# EAGLE design EbotSunny-v02 (EAGLE 7.7.0)
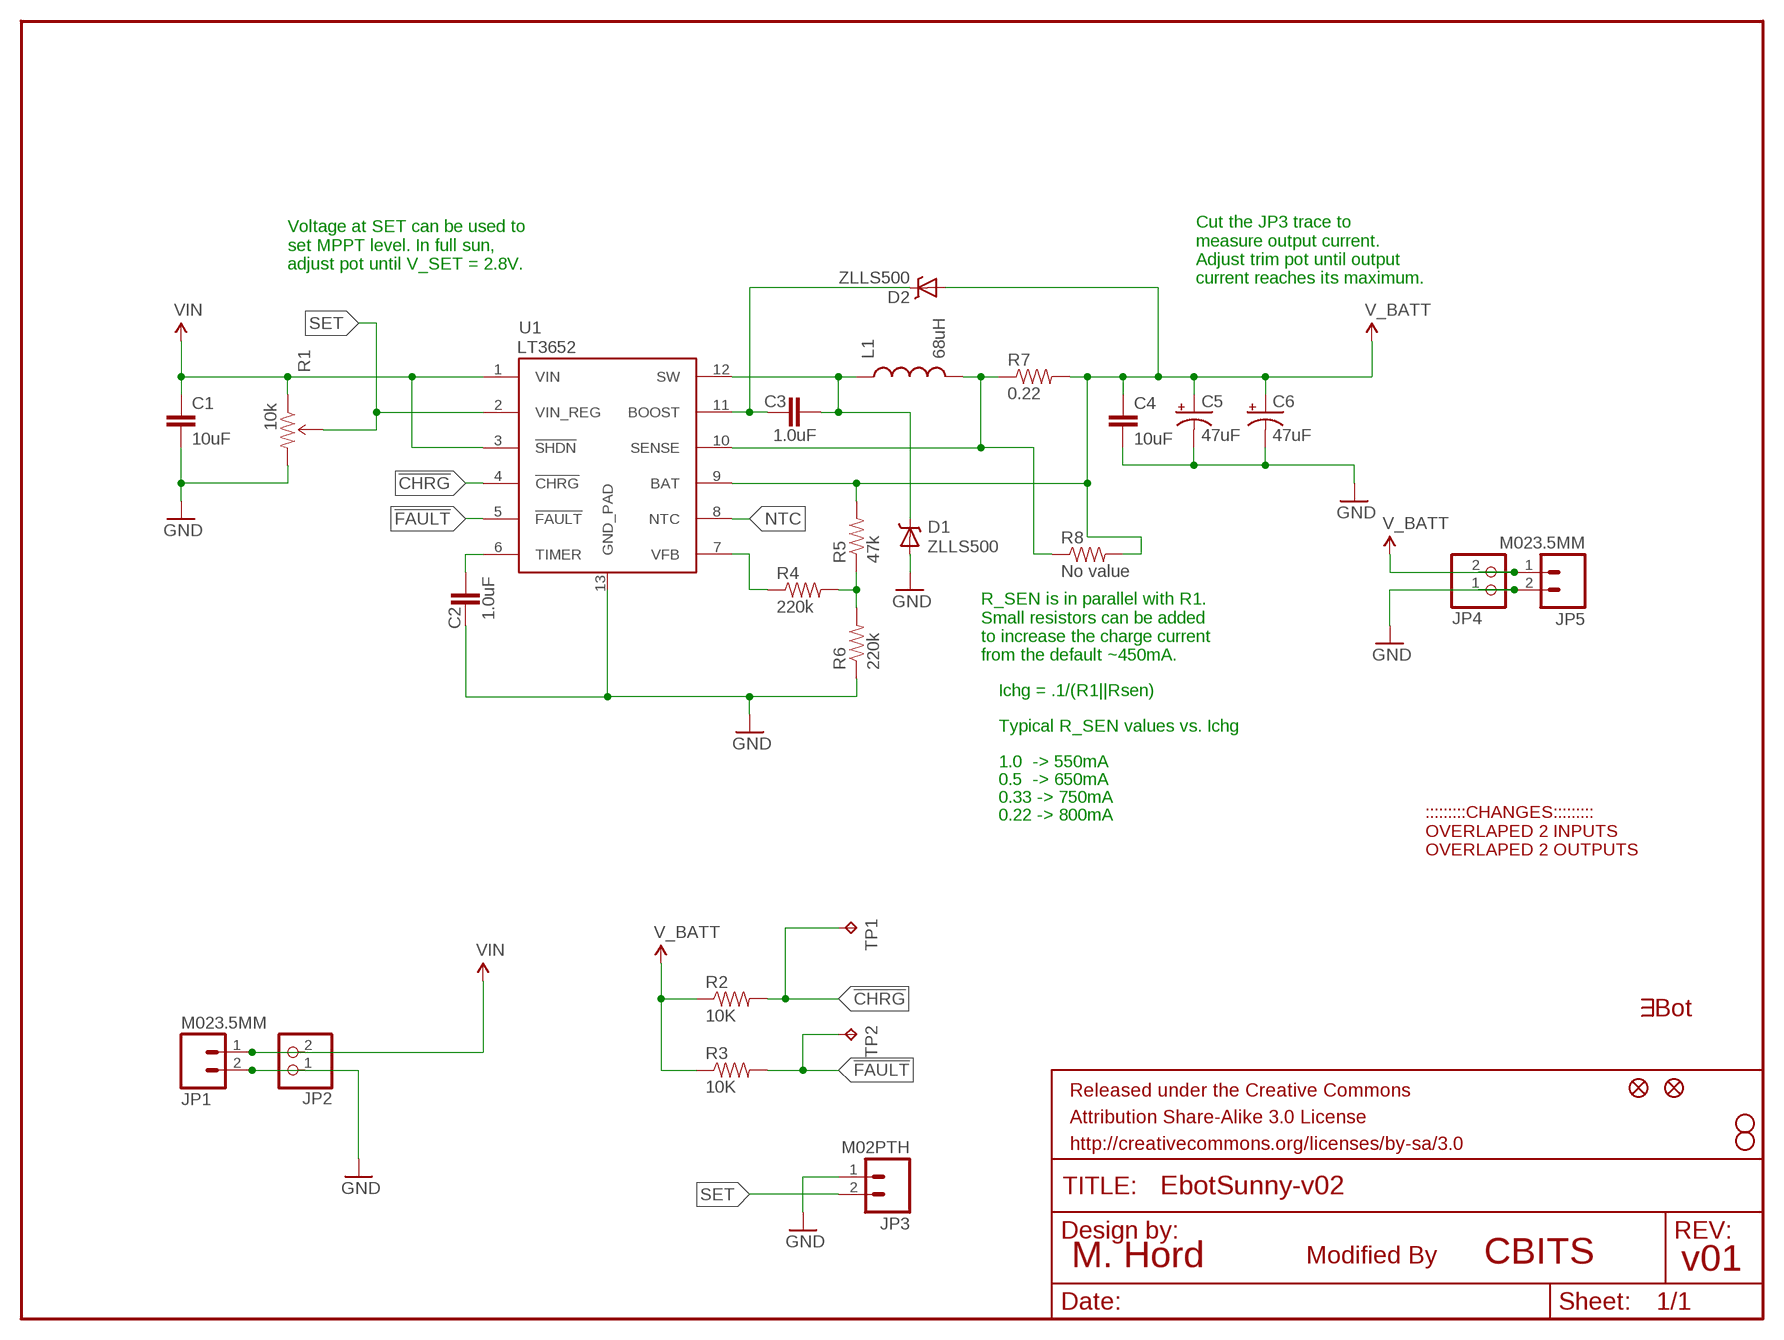
[diagram p0: schematic, sheet 1]

## Parts
C1  10uF  10UF50V20%(1210)  [1210]
C2  1.0uF  1.0UF-16V-10%(0603)  [0603-CAP]
C3  1.0uF  1.0UF-16V-10%(0603)  [0603-CAP]
C4  10uF  10UF-6.3V-20%(1206)  [1206]
C5  47uF  47UF-TANT  [EIA3528]
C6  47uF  47UF-TANT  [EIA3528]
D1  ZLLS500  ZLLS500ZLLS500  [SOT23]
D2  ZLLS500  ZLLS500ZLLS500  [SOT23]
EBOT_LOGO3  EBOT_NAME_6MM  [EBOT_NAME_6MM]
FID1  FIDUCIAL1X2  [FIDUCIAL-1X2]
FID2  FIDUCIAL1X2  [FIDUCIAL-1X2]
FRAME1  FRAME-LETTER  [CREATIVE_COMMONS]
JP1  M023.5MM  [SCREWTERMINAL-3.5MM-2]
JP2  PINHD-1X2  [1X02]
JP3  M02PTH  [1X02]
JP4  PINHD-1X2  [1X02]
JP5  M023.5MM  [SCREWTERMINAL-3.5MM-2]
L1  68uH  INDUCTOR68UH-1A  [CR75]
R1  10k  TRIMPOTRES-09285  [TRIMPOT-3MM]
R2  10K  10KOHM1/10W1%(0603)0603  [0603-RES]
R3  10K  10KOHM1/10W1%(0603)0603  [0603-RES]
R4  220k  220KOHM1/10W1%(0603)  [0603-RES]
R5  47k  47KOHM1/10W1%(0603)  [0603-RES]
R6  220k  220KOHM1/10W1%(0603)  [0603-RES]
R7  0.22  0.22OHM1/4W1%(0805)  [0805]
R8  No value  0.22OHM1/4W1%(0805)  [0805]
STANDOFF1  STAND-OFF  [STAND-OFF]
STANDOFF2  STAND-OFF  [STAND-OFF]
TP1  TPB1,27  [B1,27]
TP2  TPB1,27  [B1,27]
U1  LT3652  [MSOP-12_GND]

## Nets
!CHRG: R2.2 TP1.TP U1.4(!CHRG)
!FAULT: R3.2 TP2.TP U1.5(!FAULT)
BOOST: C3.1 D2.3(C) U1.11(BOOST)
FB: R4.2 R5.1 R6.2
GND: C1.2 C2.1 C4.2 C5.C(-) C6.C(-) D1.1(A) JP1.2 JP2.1 JP3.1 JP4.1 JP5.2 R1.3(CW) R6.1 U1.13(GND_PAD)
N$3: R4.1 U1.7(VFB)
NTC: U1.8(NTC)
SENSE: L1.P$2 R7.1 R8.1 U1.10(SENSE)
SET: JP3.2 R1.2(WIPER) U1.2(VIN_REG)
SW: C3.2 D1.3(C) L1.P$1 U1.12(SW)
TIMER: C2.2 U1.6(TIMER)
V_BATT: C4.1 C5.A(+) C6.A(+) D2.1(A) JP4.2 JP5.1 R2.1 R3.1 R5.2 R7.2 R8.2 U1.9(BAT)
VIN: C1.1 JP1.1 JP2.2 R1.1(CCW) U1.1(VIN) U1.3(!SHDN)

## Notes on the sheet
- Voltage at SET can be used to
  set MPPT level. In full sun,
  adjust pot until V_SET = 2.8V.
- Cut the JP3 trace to
  measure output current.
  Adjust trim pot until output
  current reaches its maximum.
- R_SEN is in parallel with R1.
  Small resistors can be added
  to increase the charge current
  from the default ~450mA.
- Ichg = .1/(R1||Rsen)
- Typical R_SEN values vs. Ichg
- 1.0  -> 550mA
- 0.5  -> 650mA
- 0.33 -> 750mA
- 0.22 -> 800mA
- :::::::::CHANGES:::::::::
  OVERLAPED 2 INPUTS
  OVERLAPED 2 OUTPUTS
- M. Hord | Modified By | CBITS
- v01

## Library data of the parts
C1 = SparkFun-Capacitors:10UF50V20%(1210): CAP-09824; PROD_ID: CAP-09824
C2 C3 = SparkFun-Capacitors:1.0UF-16V-10%(0603): CAP-00868; PROD_ID: CAP-00868
C4 = SparkFun-Capacitors:10UF-6.3V-20%(1206): Ceramic CAP-10057; PROD_ID: CAP-10057
C5 C6 = SparkFun-Capacitors:47UF-TANT: 47uF Tantalum SMT CAP-08310- 10V 10% (EIA-3528); PROD_ID: CAP-08310
D1 D2 = SparkFun-DiscreteSemi:ZLLS500: 700mA 40V SOT-23 Schottky; PROD_ID: DIO-08411
EBOT_LOGO3 = EbotLogos:EBOT_NAME_6MM
FID1 FID2 = SparkFun-Aesthetics:FIDUCIAL: Fiducial Alignment Points Various fiducial points for machine vision alignment.
FRAME1 = SparkFun-Aesthetics:FRAME-LETTER: Schematic Frame Standard 8.5x11 US Letter frame
JP1 JP3 JP5 = SparkFun-Connectors:M02: Standard 2-pin 0.1" header. Use with - straight break away headers ( PRT-00116) - right angle break away headers (PRT-00553) - swiss pins (PRT-00743) - machine pins (PRT-00117) - female headers (PRT-00115) Molex polarized connector foot print use with: PRT-08233 with associated crimp pins and housings. 2.54_SCREWTERM for use with PRT-10571. 3.5mm Screw Terminal footprints for PRT-08084 5mm Screw Terminal footprints for use with PRT-08433
JP2 JP4 = pinhead:PINHD-1X2: PIN HEADER
L1 = SparkFun-Passives:INDUCTOR: Inductors Basic Inductor/Choke - 0603 and 1206. Footprints are not proven and vary greatly between part numbers. SRN6045- 33uH, 20% 1.4A SDR0403-560KL - 56uH, 10%, 500mA RMS/740mA peak; PROD_ID: NDUC-09739
R1 = SparkFun-Electromechanical:TRIMPOT: Various small potentiometers for "set-and-forget" applications; PROD_ID: RES-09285
R2 R3 = SparkFun-Resistors:10KOHM1/10W1%(0603): RES-00824; PROD_ID: RES-00824
R4 R6 = SparkFun-Resistors:220KOHM1/10W1%(0603): RES-08969; PROD_ID: RES-08969
R5 = SparkFun-Resistors:47KOHM1/10W1%(0603): RES-07871; PROD_ID: RES-07871; VALUE: 47K
R7 = SparkFun-Resistors:0.22OHM1/4W1%(0805): RES-09883; PROD_ID: RES-09883
R8 = SparkFun-Resistors:0.22OHM1/4W1%(0805): RES-09883; PROD_ID: RES-09883; VALUE: 0.22
STANDOFF1 STANDOFF2 = SparkFun-Electromechanical:STAND-OFF: #4 Stand Off This is the mechanical footprint for a #4 phillips button head screw. Use the keepout ring to avoid running the screw head into surrounding components. SKU : PRT-00447
TP1 TP2 = testpad:TP: Test pad
U1 = SparkFun-PowerIC:LT3652: LT3652 MPPT Solar Charge Controller 5V-32V smart charger for batteries up to 14.4V

## Board
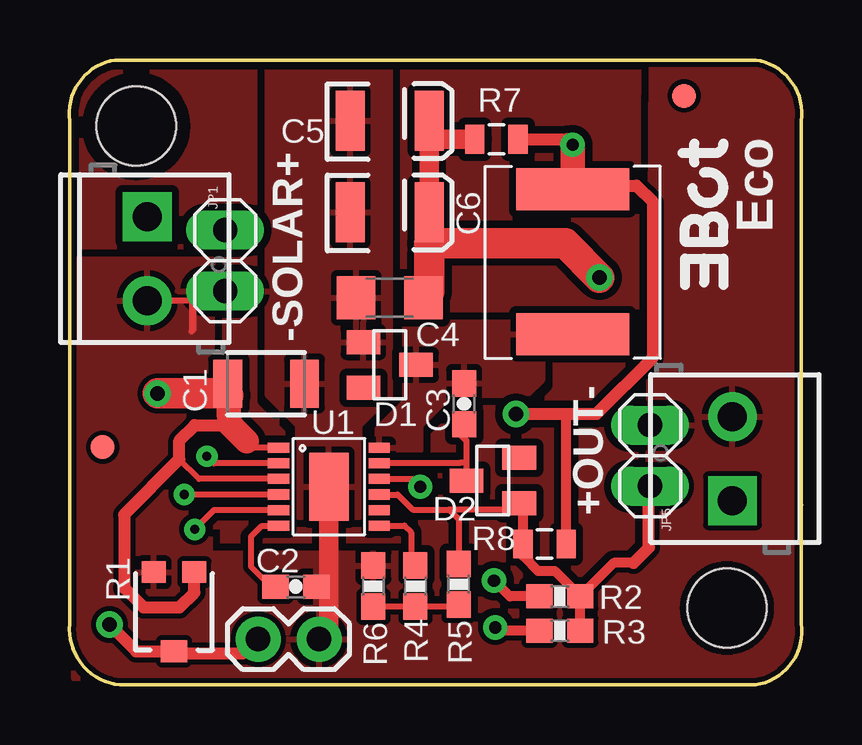
[diagram p1: board, top side]
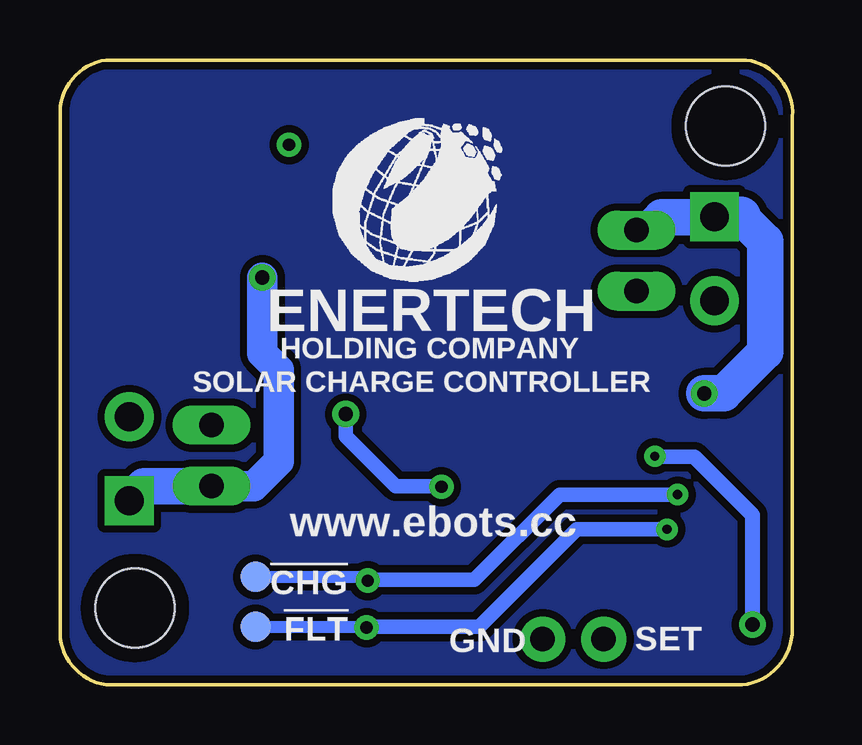
[diagram p2: board, bottom side, seen from below]

Size 30.52 x 26.04 mm. Coordinates in mm from the lower left corner, seen from the top.
Outline: 1.93,26.04 28.6,26.04 arc-90 30.5,23.49 30.5,2.54 arc-90 28.6,0 2.1,0 arc-90 0.02,2.54 0.02,23.49 arc-90 1.93,26.04
Copper layers (1*16): Top 0.035mm / dielectric 1.5mm / Bottom 0.035mm
Design rules "Sparkfun": minimum track width 8mil, minimum drill 20mil, track to track 8mil, track to pad 8mil, pad to pad 8mil, via to via 8mil, smd to smd 8mil, copper to edge 8mil, drill to drill 8mil, minimum pad ring 12mil, minimum via ring 10mil, stop-mask expansion 4mil, vias tented up to drill 20mil, thermal gap 10mil

### Footprints (pad centres in the part's own frame; a part is rotated, then mirrored left to right if it is on the bottom)
1210 = smd 1.2 x 2: 1 -1.6,0; 2 1.6,0
0603-CAP = smd 1.1 x 1: 1 -0.85,0; 2 0.85,0
1206 = smd 1.6 x 1.8: 1 -1.4,0; 2 1.4,0
EIA3528 = smd 1.2 x 2.5: A 1.65,0; C -1.65,0
SOT23 = smd 1 x 1.4: 1 -0.95,-1.1; 2 0.95,-1.1; 3 0,1.1
FIDUCIAL-1X2 = smd 1 x 1: 1 0,0
SCREWTERMINAL-3.5MM-2 = drill 1.2 pad 2.032 square: 1 0,0 | drill 1.2 pad 2.032: 2 3.5,0
1X02 = drill 1.016 long: 1 -1.27,0; 2 1.27,0
1X02' = drill 1.016 pad 1.88: 1 0,0; 2 2.54,0
CR75 = smd 1.75 x 4.7: P$1 0,0; P$2 6.05,0
TRIMPOT-3MM = smd 1 x 0.9: 1 -0.85,-1.65; 3 0.85,-1.65 | smd 1.1 x 0.9: 2 0,1.65
0603-RES = smd 1.1 x 1: 1 -0.85,0; 2 0.85,0
0805 = smd 0.8 x 1.2: 1 -0.9,0; 2 0.9,0
STAND-OFF = hole 3.302: 0,0
B1,27 = smd 1.27 x 1.27: TP 0,0
MSOP-12_GND = smd 0.889 x 0.42: 1 -2.1,1.625; 2 -2.1,0.975; 3 -2.1,0.325; 4 -2.1,-0.325; 5 -2.1,-0.975; 6 -2.1,-1.625; 7 2.1,-1.625; 8 2.1,-0.975; 9 2.1,-0.325; 10 2.1,0.325; 11 2.1,0.975; 12 2.1,1.625 | smd 1.651 x 2.845: 13 0,0

### Placement (x,y rotation side)
C1  8.2,12.55 0 top
C2  9.44,4.09 180 top
C3  16.45,11.71 90 top
C4  13.36,16.13 180 top
C5  13.36,23.49 0 top
C6  13.36,19.68 0 top
D1  13.36,13.34 270 top
D2  17.65,8.51 90 top
EBOT_LOGO3  27.35,16.66 90 top
FID1  1.39,9.91 0 top
FID2  25.62,24.54 0 top
FRAME1  23.52,-26.04 0 top  (outside the outline)
JP1  3.25,19.51 270 top
JP2  6.5,17.68 90 top
JP3  M02PTH  [1X02']  10.41,1.91 180 top
JP4  24.2,9.55 270 top
JP5  27.63,7.67 90 top
L1  20.98,14.61 90 top
R1  4.36,3.05 180 top
R2  20.44,3.68 180 top
R3  20.44,2.26 180 top
R4  14.42,4.11 270 top
R5  16.23,4.19 90 top
R6  12.67,4.11 270 top
R7  17.8,22.73 180 top
R8  19.81,5.87 180 top
STANDOFF1  2.79,23.28 0 top
STANDOFF2  27.4,3.2 0 top
TP1  22.37,4.5 0 bottom
TP2  22.37,2.41 0 bottom
U1  10.82,8.26 0 top

### Tracks (layer width: path | path; a pad name or v marks a point on that pad's centre or on a via)
!CHRG  (via drill 0.38, 0.51)
  Top 0.254: U1.4 v4.79,7.93
  Top 0.406: R2.2 18.36,3.68 v17.7,4.34
  Bottom 0.508: TP1.TP 17.85,4.5 v17.7,4.34
  Bottom 0.61: v4.79,7.93 9.69,7.93 13.25,4.37 17.67,4.37 v17.7,4.34
!FAULT  (via drill 0.38, 0.51)
  Top 0.254: U1.5 6.03,7.28 v5.23,6.48
  Top 0.406: R3.2 17.88,2.26 v17.75,2.39
  Bottom 0.508: TP2.TP 17.78,2.41 | 17.78,2.41 v17.75,2.39 | 17.78,2.41 17.7,2.41
  Bottom 0.61: v5.23,6.48 8.99,6.48 13.05,2.41 17.72,2.41 v17.75,2.39
BOOST
  Top 0.254: C3.1 16.12,10.6 16.55,10.18 16.55,9.27 | U1.11 12.98,9.17 13.05,9.25 16.28,9.25 16.3,9.27 16.55,9.27 | 16.55,9.27 D2.3
FB
  Top 0.254: R6.2 R4.2 16.15,3.26 R5.1
GND
  Top 0.254: JP2.1 6.44,16.79 5.25,16.79 5.1,16.64 5.1,14.73 5.18,14.81 5.18,16.05 5.13,16 3.73,16
  Top 0.813: U1.13 10.82,1.91
  Bottom 1.27: 3.58,16.06 JP1.2
  pour Top (isolate 0.305): 13.36,26.04 13.36,12.06 12.09,10.79 12.09,6.99 9.55,6.99 9.55,10.79 8.28,12.06 8.28,26.04
  pour Top: 0.02,1.27 -0.03,9.6 0.2,17.75 5.96,17.73 5.86,5.49 20.37,5.49 24.13,5.46 24.28,25.73 30.4,25.68 30.32,10.57 30.22,1.24 29.38,0.41 0.02,0
N$1
  pour Top (isolate 0.305, rank 2, no thermals): 0.38,25.78 30.22,25.65 30.17,0.53 0.2,0.25
N$2
  pour Bottom (isolate 0.305, rank 2, no thermals): 0.12,25.53 30.02,25.73 30.02,0.43 0.38,0.53
N$3
  Top 0.254: U1.7 13.96,6.63 14.24,6.35 14.24,5.14 R4.1
SENSE  (via drill 0.51, 0.6)
  Top 0.254: U1.10 14.3,8.58 v14.63,8.26
  Top 0.406: R8.1 20.71,11.11 20.54,11.28
  Top 0.508: R7.1 20.75,22.73 v20.98,22.5 | L1.P$2 21.12,20.8 23.64,20.8 24.3,20.14 24.3,13.61 21.97,11.28 20.54,11.28 v18.61,11.28
  Top 1.016: v20.98,22.5 L1.P$2
  Bottom 0.406: v14.63,8.26 14.73,8.36
  Bottom 0.61: v18.61,11.28 18.61,10.36 16.53,8.28 14.65,8.28 v14.63,8.26
SET  (via drill 0.38, 0.6)
  Top 0.254: U1.2 6.03,9.23 v5.74,9.53
  Top 0.508: JP3.2 7.29,1.32 4.44,1.32 R1.2 2.79,1.4 v1.67,2.51
  Bottom 0.61: 4.08,9.5 5.71,9.5 v5.74,9.53
  Bottom 0.635: 4.08,9.5 1.67,7.09 v1.67,2.51
SW
  pour Top (isolate 0.305): 13.99,15.11 19.71,15.11 19.71,12.7 19.07,12.06 15.9,12.06 14.63,10.79 14.63,9.78 12.85,9.78 12.85,10.67 13.99,11.81
TIMER
  Top 0.254: U1.6 8.69,6.6 8,6.6 7.56,6.17 7.56,4.93 8.59,3.9 C2.2
V_BATT  (via drill 0.6)
  Top 0.254: U1.9 13.68,7.93 14.31,7.31 15.83,7.31 | 14.63,16.26 C4.1 | 15.83,7.31 16.23,6.91 R5.2 | D2.1 18.49,7.31 15.83,7.31
  Top 0.406: D2.1 18.91,7.4 R8.2 18.91,5.37 19.53,4.75 20.23,4.75 R2.1 | R3.1 R2.1 | 23.52,5.08 22.69,5.08 R2.1
  Top 0.508: 23.52,5.08 24.15,5.71 24.15,8.26 | 24.15,8.26 24.15,8.5 JP4.2 24.18,8.55 23.83,8.2 24.09,8.2 24.15,8.26
  Top 0.813: C6.A 15.01,22.73 | 15.01,22.73 C5.A | R7.2 15.01,22.73
  Top 1.016: C6.A 15.01,18.39 15.01,17.91 | 14.88,16.25 C4.1
  Top 1.27: v22.09,16.97 20.67,18.39 15.01,18.39 | 15.01,17.91 15.01,16.38 C4.1
  Bottom 0.508: 23.44,8.61 24.14,8.61 JP4.2
  Bottom 1.27: JP4.2 22.45,8.28 21.41,9.32 21.41,13.13 22.09,13.82 v22.09,16.97
  Bottom 1.524: JP5.1 27.02,8.28 JP4.2
VIN  (via drill 0.6)
  Top 0.254: U1.1 7.67,9.88 7.39,10.16 | U1.3 5.41,8.58 4.59,9.4
  Top 0.508: 6.68,10.87 6.62,10.82 5.23,10.82 4.59,10.19 4.59,9.4 2.28,7.09 2.28,4.04 3.09,3.23 4.59,3.23 5.21,3.85 R1.1
  Top 1.016: C1.1 6.62,12.06 6.68,10.87 7.39,10.16
  Top 1.27: v3.68,12.14 6.54,12.14 6.62,12.06
  Bottom 1.524: 2.15,19.51 1.14,18.49 1.14,13.87 2.87,12.14 v3.68,12.14 | JP1.1 3.27,19.48 5.46,19.48 5.99,18.95 JP2.2
  Bottom 1.676: JP1.1 2.15,19.51

### Text on the board
tPlace: -SOLAR+ | Eco | +OUT-
bPlace: ENERTECH | HOLDING COMPANY | SOLAR CHARGE CONTROLLER | www.ebots.cc | !CHG | SET | !FLT | GND